# EAGLE design Game of Life Colour (EAGLE 9.6.2)
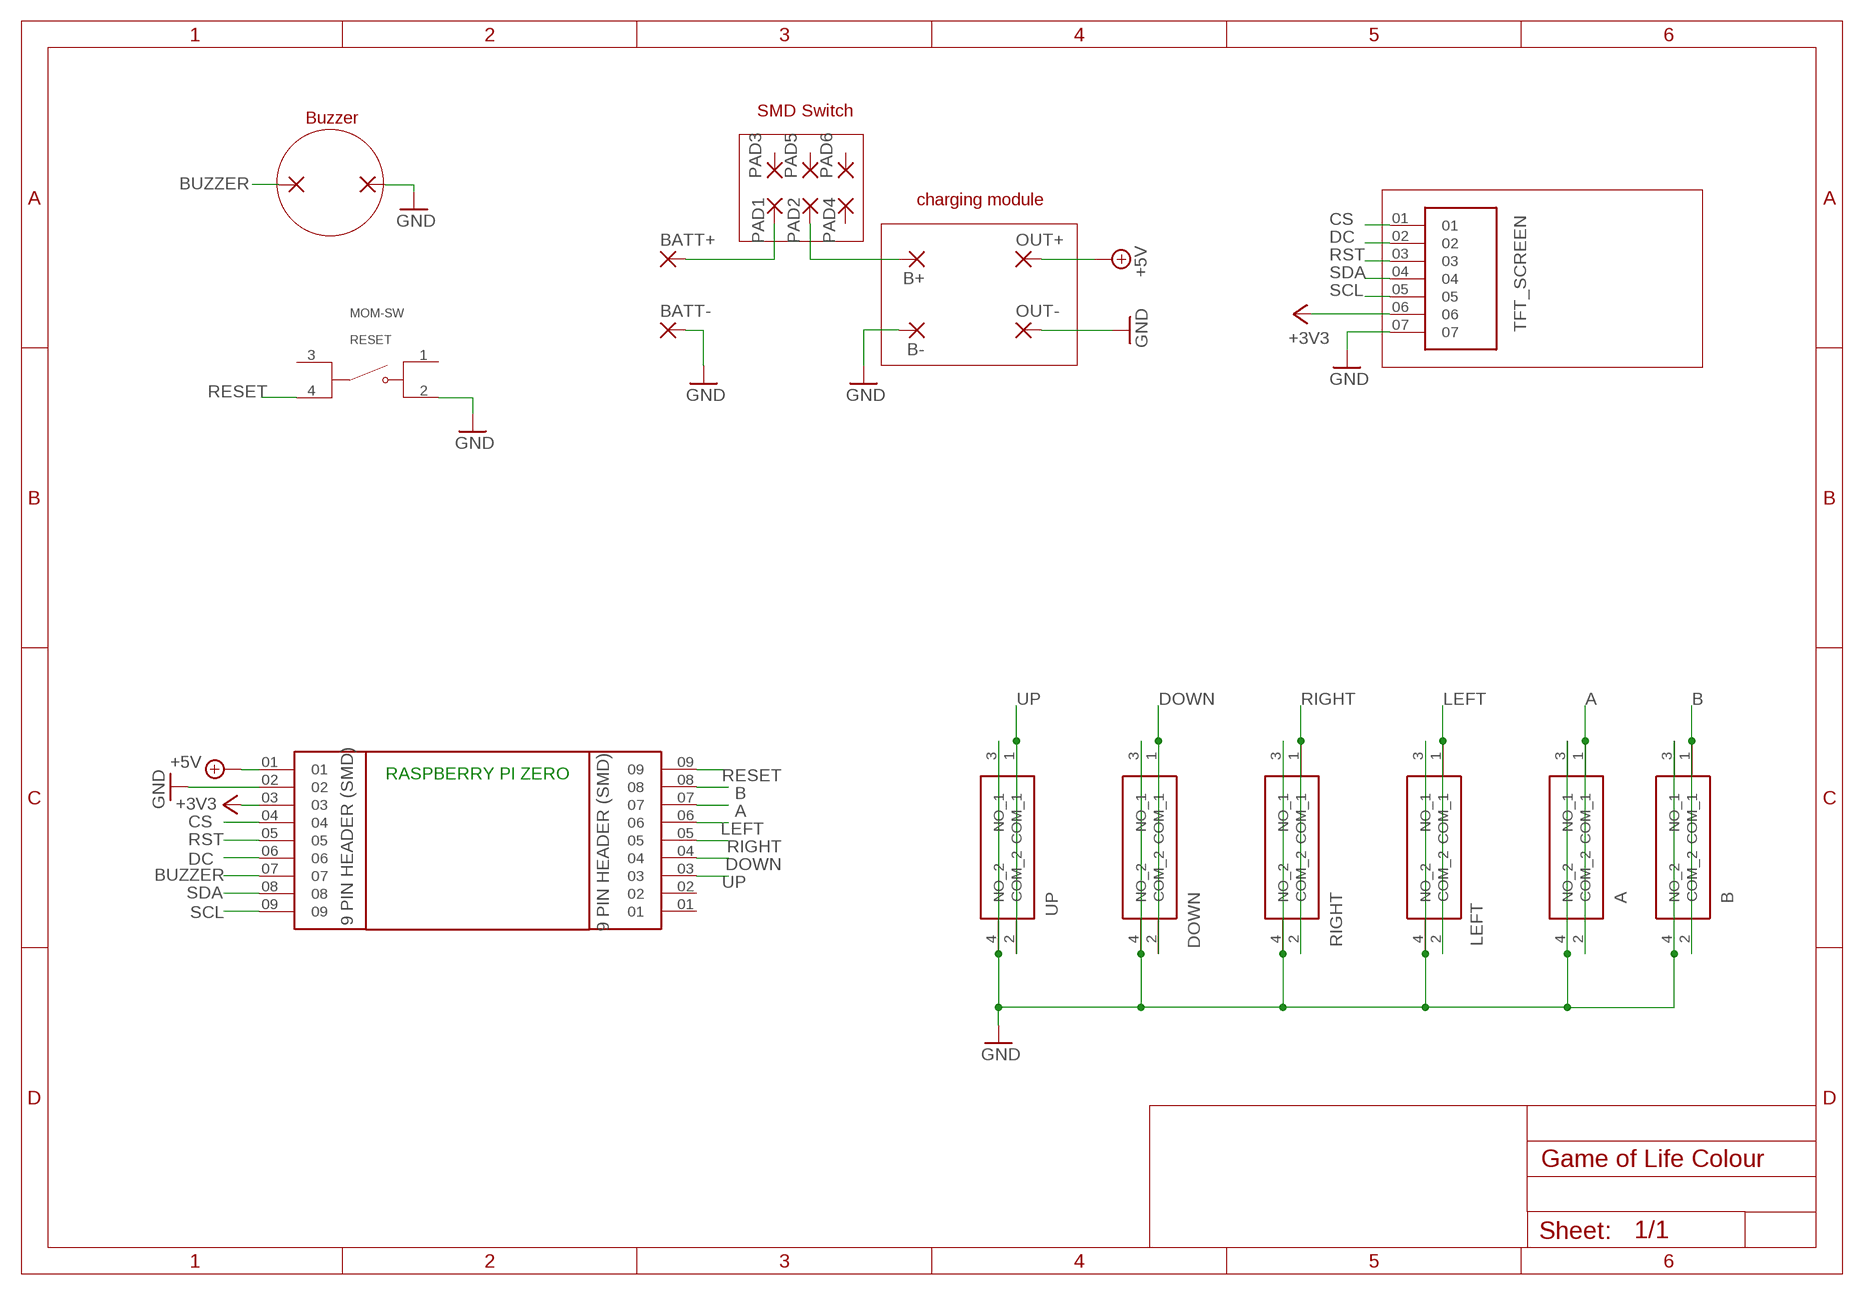
[diagram p0: schematic, sheet 1]

## Parts
A  101-0364-EV  [1010364EV]
B  101-0364-EV  [1010364EV]
B+  SMD5  [SMD2,54-5,08]
B-  SMD5  [SMD2,54-5,08]
BATT+  SMD5  [SMD2,54-5,08]
BATT-  SMD5  [SMD2,54-5,08]
DOWN  101-0364-EV  [1010364EV]
J2  9 PIN HEADER (SMD)  TMM-108-X-X-S-SM  [SAMTEC_TMM-108-X-X-S-SM]
J3  9 PIN HEADER (SMD)  TMM-108-X-X-S-SM  [SAMTEC_TMM-108-X-X-S-SM]
LEFT  101-0364-EV  [1010364EV]
OUT+  SMD5  [SMD2,54-5,08]
OUT-  SMD5  [SMD2,54-5,08]
PAD1  SMD2  [SMD1,27-2,54]
PAD2  SMD2  [SMD1,27-2,54]
PAD3  SMD2  [SMD1,27-2,54]
PAD4  SMD2  [SMD1,27-2,54]
PAD5  SMD2  [SMD1,27-2,54]
PAD6  SMD2  [SMD1,27-2,54]
PAD7  SMD2  [SMD1,27-2,54]
PAD8  SMD2  [SMD1,27-2,54]
RESET  MOM-SW  TS18-5-25-SL-260-SMT-TR  [SW_TS18-5-25-SL-260-SMT-TR]
RIGHT  101-0364-EV  [1010364EV]
TFT_SCREEN  TMM-108-X-X-S-SM  [SAMTEC_TMM-108-X-X-S-SM]
UP  101-0364-EV  [1010364EV]

## Nets
+3V3: J3.03 TFT_SCREEN.06
+5V: J3.01 OUT+.1(P)
A: A.1(COM_1) A.2(COM_2) J2.07
B: B.1(COM_1) B.2(COM_2) J2.08
BUZZER: J3.07 PAD7.1(P)
CS: J3.04 TFT_SCREEN.01
DC: J3.06 TFT_SCREEN.02
DOWN: DOWN.1(COM_1) DOWN.2(COM_2) J2.04
GND: A.3(NO_1) A.4(NO_2) B-.1(P) B.3(NO_1) B.4(NO_2) BATT-.1(P) DOWN.3(NO_1) DOWN.4(NO_2) J3.02 LEFT.3(NO_1) LEFT.4(NO_2) OUT-.1(P) PAD8.1(P) RESET.2 RIGHT.3(NO_1) RIGHT.4(NO_2) TFT_SCREEN.07 UP.3(NO_1) UP.4(NO_2)
LEFT: J2.06 LEFT.1(COM_1) LEFT.2(COM_2)
N$8: BATT+.1(P) PAD1.1(P)
N$9: B+.1(P) PAD2.1(P)
RESET: J2.09 RESET.4
RIGHT: J2.05 RIGHT.1(COM_1) RIGHT.2(COM_2)
RST: J3.05 TFT_SCREEN.03
SCL: J3.09 TFT_SCREEN.05
SDA: J3.08 TFT_SCREEN.04
UP: J2.03 UP.1(COM_1) UP.2(COM_2)
Unconnected: J2.01 J2.02 PAD3.1(P) PAD4.1(P) PAD5.1(P) PAD6.1(P) RESET.1 RESET.3

## Notes on the sheet
- SMD Switch
- Buzzer
- charging module
- RASPBERRY PI ZERO

## Library data of the parts
A B DOWN LEFT RIGHT UP = Switch_Omron_SMD:101-0364-EV: Tactile Switches TACTILE SWITCH 6X6MM Source: Datasheet <https://componentsearchengine.com/Datasheets/1/101-0364-EV.pdf>; DESCRIPTION: Tactile Switches TACTILE SWITCH 6X6MM; HEIGHT: 2mm; MANUFACTURER_NAME: Mountain Switch; MANUFACTURER_PART_NUMBER: 101-0364-EV; MOUSER_PART_NUMBER: 101-0364-EV; MOUSER_PRICE-STOCK: https://www.mouser.co.uk/ProductDetail/Mountain-Switch/101-0364-EV?qs=Np9hobi9ysLawDJP688e5g%3D%3D
B+ B- BATT+ BATT- OUT+ OUT- = wirepad:SMD5: SMD PAD
J2 J3 = 9 Pin Header SMD:TMM-108-X-X-S-SM: Check availability <https://pricing.snapeda.com/parts/TMM-108-01-S-S-SM/Samtec/view-part?ref=eda>; AVAILABILITY: In Stock; CHECK_PRICES: https://www.snapeda.com/parts/TMM-108-01-S-S-SM/Samtec/view-part/?ref=eda; DESCRIPTION: Connector Header Surface Mount 8 position 0.079 (2.00mm); MF: Samtec; MP: TMM-108-01-S-S-SM; PACKAGE: None; PRICE: None; SNAPEDA_LINK: https://www.snapeda.com/parts/TMM-108-01-S-S-SM/Samtec/view-part/?ref=snap
PAD1-PAD8 = wirepad:SMD2: SMD PAD
RESET = TS18-5-25-SL-260-SMT-TR:TS18-5-25-SL-260-SMT-TR: Check availability <https://pricing.snapeda.com/parts/TS18-5-25-SL-260-SMT-TR/Same%20Sky/view-part?ref=eda>; AVAILABILITY: In Stock; CHECK_PRICES: https://www.snapeda.com/parts/TS18-5-25-SL-260-SMT-TR/Same+Sky/view-part/?ref=eda; DESCRIPTION: 5 x 5 mm, 2.5 mm Actuator Height, 260 gf, Silver, Surface Mount, TR, SPST, Tactile Switch; MF: Same Sky; MP: TS18-5-25-SL-260-SMT-TR; PACKAGE: None; PRICE: None; SNAPEDA_LINK: https://www.snapeda.com/parts/TS18-5-25-SL-260-SMT-TR/Same+Sky/view-part/?ref=snap
TFT_SCREEN = 7 Pin Header SMD STRAIGHT:TMM-108-X-X-S-SM: Check availability <https://pricing.snapeda.com/parts/TMM-108-01-S-S-SM/Samtec/view-part?ref=eda>; AVAILABILITY: In Stock; CHECK_PRICES: https://www.snapeda.com/parts/TMM-108-01-S-S-SM/Samtec/view-part/?ref=eda; DESCRIPTION: Connector Header Surface Mount 8 position 0.079 (2.00mm); MF: Samtec; MP: TMM-108-01-S-S-SM; PACKAGE: None; PRICE: None; SNAPEDA_LINK: https://www.snapeda.com/parts/TMM-108-01-S-S-SM/Samtec/view-part/?ref=snap

## Board
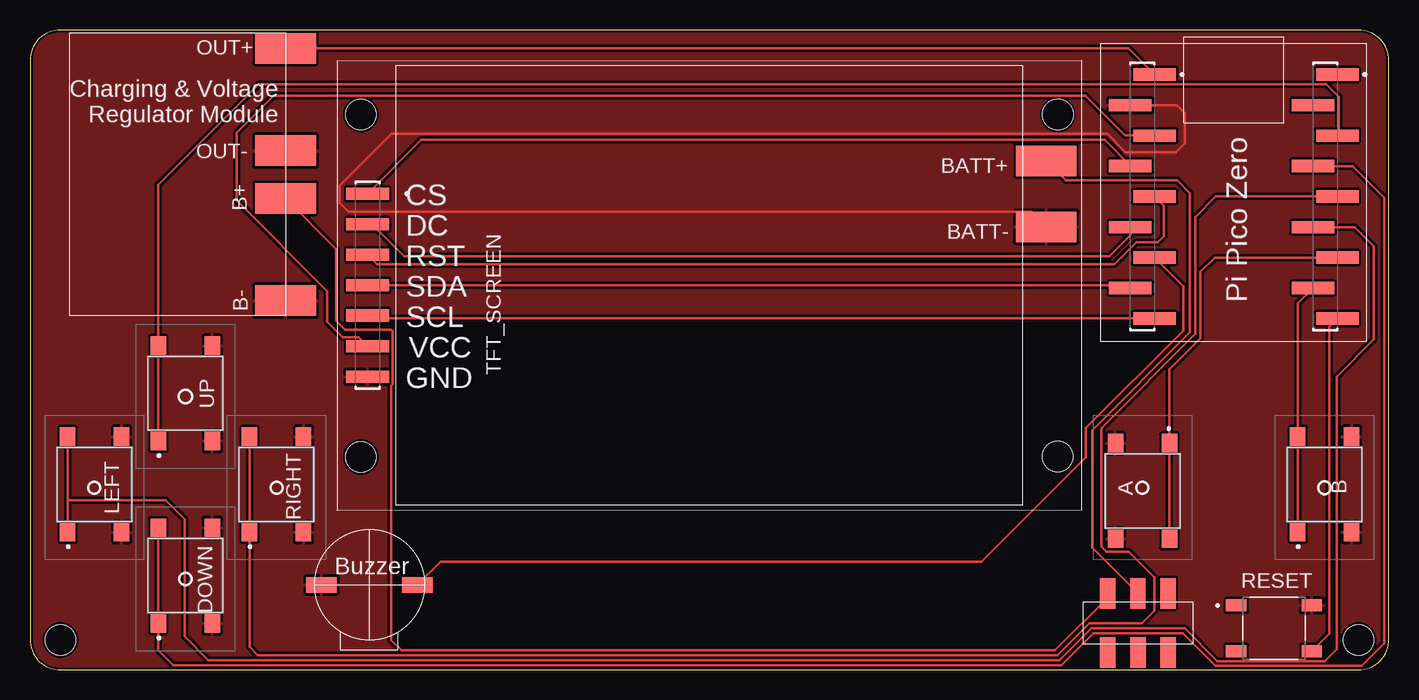
[diagram p1: board, top side]
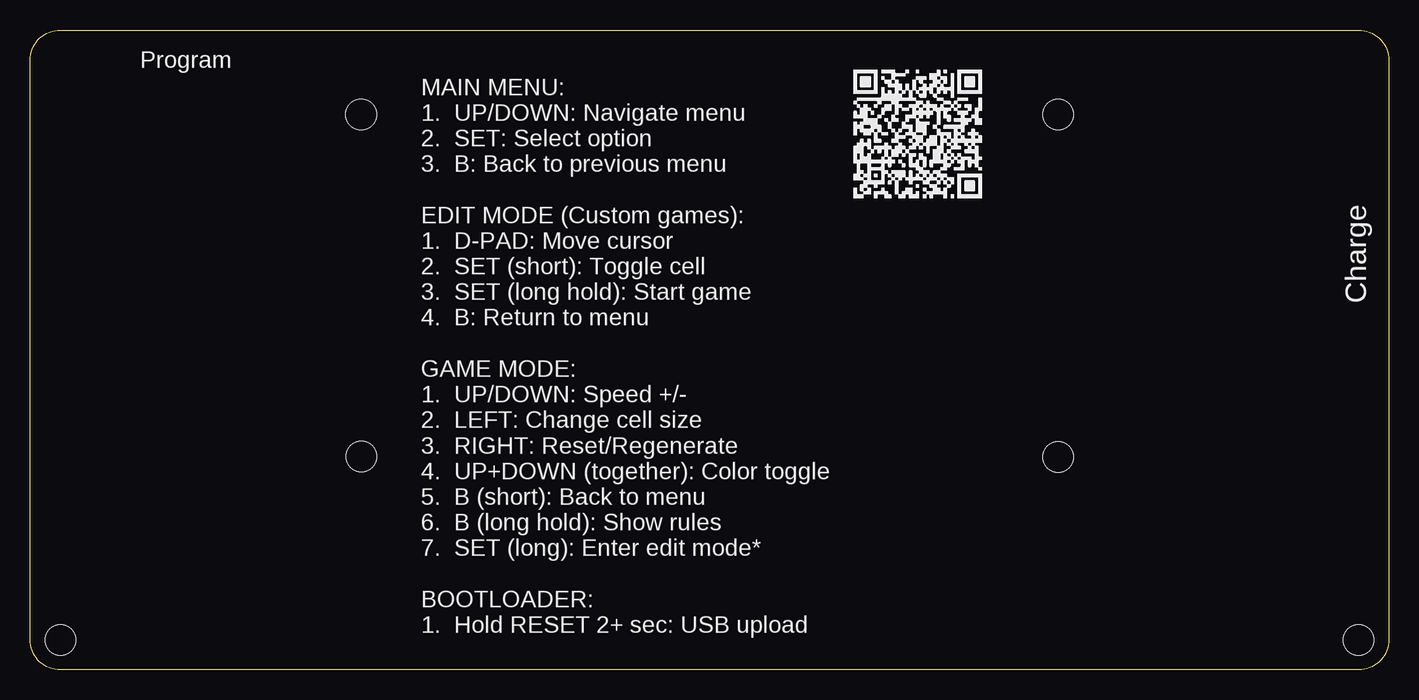
[diagram p2: board, bottom side, seen from below]

Size 113.28 x 53.33 mm. Coordinates in mm from the lower left corner, seen from the top.
Outline: 113.28,2.54 113.28,50.79 arc90 110.74,53.33 2.54,53.33 arc90 0,50.79 0,2.54 arc90 2.54,0 110.74,0 arc90 113.28,2.54
Copper layers (1*16): Top 0.035mm / dielectric 1.5mm / Bottom 0.035mm
Design rules "SparkFun": minimum track width 8mil, minimum drill 20mil, track to track 8mil, track to pad 8mil, pad to pad 8mil, via to via 8mil, smd to smd 8mil, copper to edge 8mil, drill to drill 8mil, minimum pad ring 12mil, minimum via ring 10mil, stop-mask expansion 4mil, vias tented up to drill 20mil, thermal gap 10mil
Holes 2.54 mm at 27.58,46.28 85.69,46.28 85.66,17.78 27.58,17.75 2.54,2.49 110.74,2.49

### Footprints (pad centres in the part's own frame; a part is rotated, then mirrored left to right if it is on the bottom)
1010364EV = smd 1.55 x 1.3: 1 -3.7,2.25; 2 4.25,2.25; 3 -3.7,-2.25; 4 4.25,-2.25
SMD2,54-5,08 = smd 2.54 x 5.08: 1 0,0
SAMTEC_TMM-108-X-X-S-SM = smd 1.016 x 3.556: 01 -7,1.016; 02 -4.441,-1.016; 03 -1.908,1.016; 04 0.626,-1.016; 05 3.159,1.016; 06 5.718,-1.016; 07 8.251,1.016; 08 10.791,-1.016; 09 13.331,1.016
SMD1,27-2,54 = smd 1.27 x 2.54: 1 0,0
SW_TS18-5-25-SL-260-SMT-TR = smd 1.7 x 1: 1 -3.15,1.9; 2 3.15,1.9; 3 -3.15,-1.9; 4 3.15,-1.9
SAMTEC_TMM-108-X-X-S-SM' = smd 1.016 x 3.556: 01 -7,0; 02 -4.441,0; 03 -1.908,0; 04 0.626,0; 05 3.159,0; 06 5.718,0; 07 8.251,0

### Placement (x,y rotation side)
A  92.74,15.19 270 top
B  107.92,15.19 90 top
B+  21.31,39.29 270 top
B-  21.31,30.78 270 top
BATT+  84.71,42.42 90 top
BATT-  84.71,36.93 90 top
DOWN  12.95,7.59 90 top
J2  107.98,42.62 270 top
J3  92.74,42.62 270 top
LEFT  5.38,15.19 90 top
OUT+  21.31,51.79 90 top
OUT-  21.31,43.28 270 top
PAD1  92.35,6.38 180 top
PAD2  89.84,6.38 180 top
PAD3  94.87,6.38 180 top
PAD4  89.84,1.47 0 top
PAD5  92.38,1.47 0 top
PAD6  94.87,1.47 0 top
PAD7  32.28,7.09 90 top
PAD8  24.31,7.09 90 top
RESET  103.71,3.48 0 top
RIGHT  20.55,15.19 90 top
TFT_SCREEN  TMM-108-X-X-S-SM  [SAMTEC_TMM-108-X-X-S-SM']  28.14,32.69 270 top
UP  12.95,22.78 90 top

### Tracks (layer width: path | path; a pad name or v marks a point on that pad's centre or on a via)
+3V3
  Top 0.203: J3.03 93.73,44.55 91.26,44.55 87.96,47.85 20.3,47.85 17.23,44.79 17.23,39.13 24.79,31.57 24.79,29 26.06,27.73 27.38,27.73 TFT_SCREEN.06
+5V
  Top 0.203: J3.01 91.58,51.79 OUT+.1
A
  Top 0.203: J2.07 98.76,34.37 97.56,33.17 97.56,27.63 94.99,25.05 A.1 A.2
B
  Top 0.203: B.1 B.2 105.67,30.55 J2.08
BUZZER
  Top 0.203: J3.07 96.14,31.98 96.14,28.27 88.04,20.17 88.04,17.73 79.32,9.02 34.21,9.02 PAD7.1
CS
  Top 0.203: J3.04 91.72,42.04 89.59,44.17 32.62,44.17 TFT_SCREEN.01
DC
  Top 0.203: TFT_SCREEN.02 28.52,37.13 31.19,34.46 89.97,34.46 91.72,36.22 J3.06
DOWN
  Top 0.203: DOWN.2 DOWN.1 10.69,3.88 10.69,1.65 11.94,0.41 85.98,0.41 88.65,3.07 96.09,3.07 98.83,0.34 111.02,0.34 112.9,2.22 112.9,39.35 110.25,42 J2.04
GND
  Top 0.203: J3.02 95.58,47.06 96.27,46.38 96.27,43.89 95.53,43.15 91.33,43.15 89.81,44.68 30.15,44.68 25.81,40.34 25.81,38.94 26.57,38.18 83.46,38.18 BATT-.1
  pour Top: -0.1,53.54 113.44,53.54 113.44,-0.05 -0.1,-0.05
LEFT
  Top 0.203: LEFT.2 3.13,14.12 | 3.13,14.12 LEFT.1 | 3.13,14.12 11.33,14.12 12.88,12.57 12.88,2.79 14.86,0.81 85.81,0.81 88.48,3.48 96.26,3.48 98.99,0.74 107.96,0.74 108.94,1.73 108.94,24.45 112.04,27.55 112.04,35.31 110.44,36.9 J2.06
N$8
  Top 0.203: BATT+.1 86.33,40.79 95.63,40.79 96.71,39.72 96.71,28.13 88.54,19.96 88.54,10.19 PAD1.1
N$9
  Top 0.203: B+.1 25.53,35.08 25.53,29.11 26.29,28.35 30.1,28.35 30.23,28.22 30.23,23.8 30.12,23.7 30.12,2.49 30.99,1.63 85.45,1.63 89.84,6.02 PAD2.1
RESET
  Top 0.203: RESET.4 108.31,3.03 108.31,28.6 J2.09
RIGHT
  Top 0.203: RIGHT.2 RIGHT.1 18.3,1.92 19,1.22 85.64,1.22 88.31,3.89 92.68,3.89 93.73,4.93 93.73,7.72 91.59,9.86 89.71,9.86 89.31,10.26 89.31,20.15 97.16,28 97.16,37.74 98.87,39.46 J2.05
RST
  Top 0.203: TFT_SCREEN.03 28.93,33.81 90.4,33.81 92.23,35.64 94.01,35.64 94.51,36.14 94.51,38.7 J3.05
SCL
  Top 0.203: J3.09 28.38,29.29 TFT_SCREEN.05
SDA
  Top 0.203: TFT_SCREEN.04 91.49,32.06 J3.08
UP
  Top 0.203: UP.1 UP.2 10.7,40.45 19.05,48.79 108.05,48.79 109.09,47.75 109.09,44.63 J2.03

### Text on the board
tPlace: Charging & Voltage / Regulator Module | CS | DC | RST | SDA | Pi Pico Zero | SCL | VCC | GND | Buzzer
bPlace: Program | Charge | MAIN MENU: / 1. UP/DOWN: Navigate menu / 2. SET: Select option / 3. B: Back to previous menu / / EDIT MODE (Custom games): / 1. D-PAD: Move cursor / 2. SET (short): Toggle cell / 3. SET (long hold): Start game / 4. B: Return to menu / / GAME MODE: / 1. UP/DOWN: Speed +/- / 2. LEFT: Change cell size / 3. RIGHT: Reset/Regenerate / 4. UP+DOWN (together): Color toggle / 5. B (short): Back to menu / 6. B (long hold): Show rules / 7. SET (long): Enter edit mode* / / BOOTLOADER: / 1. Hold RESET 2+ sec: USB upload